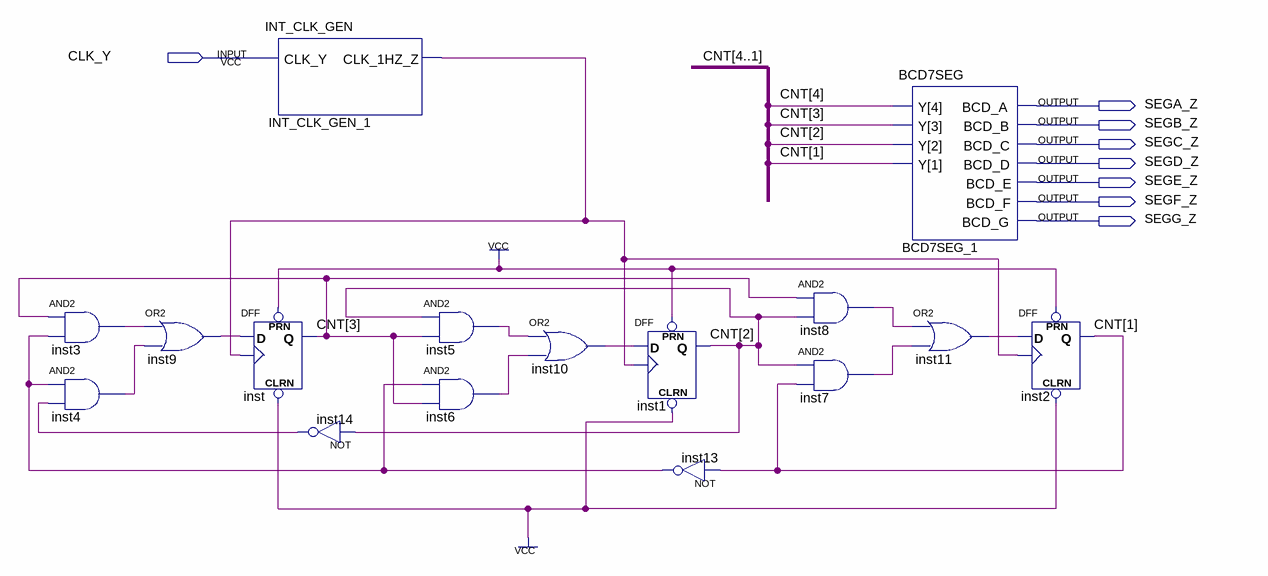
[diagram p0: schematic sheet]
// Quartus schematic designtemplate.bdf as structural Verilog: 16 symbols, 8 pins
module designtemplate (
  input  CLK_Y,
  output SEGA_Z,
  output SEGB_Z,
  output SEGC_Z,
  output SEGD_Z,
  output SEGE_Z,
  output SEGF_Z,
  output SEGG_Z
);

  wire inst3_out, inst4_out, inst5_out, inst6_out, inst7_out, inst8_out, inst9_out, inst10_out, inst11_out,
       inst13_out, inst14_out, INT_CLK_GEN_1_clk_1hz_z;
  wire [4:1] CNT;

  and inst3 (inst3_out, CNT[3], inst13_out);
  and inst4 (inst4_out, inst13_out, inst14_out);
  or inst9 (inst9_out, inst3_out, inst4_out);
  INT_CLK_GEN INT_CLK_GEN_1 (.CLK_Y(CLK_Y), .CLK_1HZ_Z(INT_CLK_GEN_1_clk_1hz_z));
  DFF inst (.CLRN(1'b1), .CLK(INT_CLK_GEN_1_clk_1hz_z), .D(inst9_out), .PRN(1'b1), .Q(CNT[3]));
  not inst14 (inst14_out, CNT[2]);
  and inst5 (inst5_out, CNT[2], CNT[3]);
  and inst6 (inst6_out, inst13_out, CNT[3]);
  or inst10 (inst10_out, inst5_out, inst6_out);
  DFF inst1 (.CLRN(1'b1), .CLK(INT_CLK_GEN_1_clk_1hz_z), .D(inst10_out), .PRN(1'b1), .Q(CNT[2]));
  not inst13 (inst13_out, CNT[1]);
  and inst8 (inst8_out, CNT[3], CNT[2]);
  and inst7 (inst7_out, CNT[2], CNT[1]);
  BCD7SEG BCD7SEG_1 (
    .Y(CNT), .BCD_A(SEGA_Z), .BCD_B(SEGB_Z), .BCD_C(SEGC_Z), .BCD_D(SEGD_Z), .BCD_E(SEGE_Z), .BCD_F(SEGF_Z),
    .BCD_G(SEGG_Z));
  or inst11 (inst11_out, inst8_out, inst7_out);
  DFF inst2 (.CLRN(1'b1), .CLK(INT_CLK_GEN_1_clk_1hz_z), .D(inst11_out), .PRN(1'b1), .Q(CNT[1]));
endmodule
